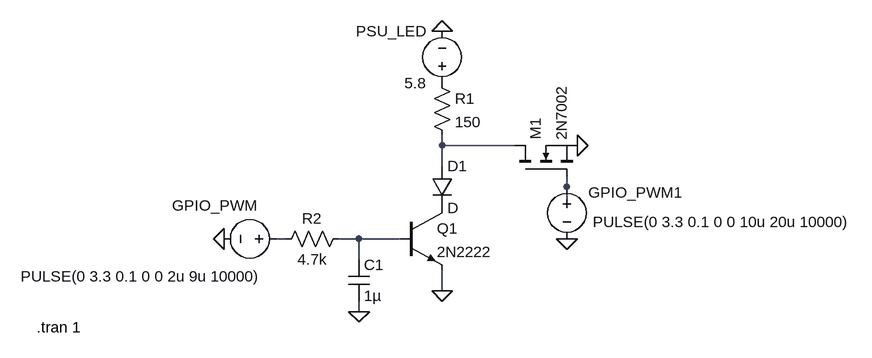
[diagram p0: schematic Draft1.asc]
Draft1.asc, the LTspice schematic file:
Version 4
SHEET 1 952 692
WIRE 224 128 224 112
WIRE 336 128 224 128
WIRE 224 160 224 128
WIRE 416 192 416 176
WIRE 416 224 416 192
WIRE -16 272 -32 272
WIRE 96 272 64 272
WIRE 160 272 96 272
WIRE 96 304 96 272
WIRE 224 352 224 320
WIRE 96 384 96 368
FLAG 224 -48 0
FLAG 224 352 0
FLAG 96 384 0
FLAG -112 272 0
FLAG 432 128 0
FLAG 416 272 0
SYMBOL res 208 16 R0
SYMATTR InstName R1
SYMATTR Value 150
SYMBOL voltage 224 48 R180
WINDOW 0 24 96 Left 2
WINDOW 3 24 16 Left 2
WINDOW 123 0 0 Left 0
WINDOW 39 0 0 Left 0
SYMATTR InstName PSU_LED
SYMATTR Value 5.8
SYMBOL diode 208 160 R0
SYMATTR InstName D1
SYMBOL npn 160 224 R0
SYMATTR InstName Q1
SYMATTR Value 2N2222
SYMBOL res 80 256 R90
WINDOW 0 0 56 VBottom 2
WINDOW 3 32 56 VTop 2
SYMATTR InstName R2
SYMATTR Value 4.7k
SYMBOL cap 80 304 R0
SYMATTR InstName C1
SYMATTR Value 1µ
SYMBOL voltage -16 272 R90
WINDOW 0 -36 110 VBottom 2
WINDOW 3 42 223 VTop 2
WINDOW 123 0 0 Left 0
WINDOW 39 0 0 Left 0
SYMATTR InstName GPIO_PWM
SYMATTR Value PULSE(0 3.3 0.1 0 0 2u 9u 10000)
SYMBOL nmos 336 176 R270
SYMATTR InstName M1
SYMATTR Value 2N7002
SYMBOL voltage 416 176 R0
WINDOW 0 106 40 Bottom 2
WINDOW 3 239 54 Top 2
WINDOW 123 0 0 Left 0
WINDOW 39 0 0 Left 0
SYMATTR InstName GPIO_PWM1
SYMATTR Value PULSE(0 3.3 0.1 0 0 10u 20u 10000)
TEXT -400 408 Left 2 !.tran 1

The netlist it stands for:
* Draft1.asc
R1 P001 N001 150
V§PSU_LED P001 0 5.8
D1 N001 P002 D
Q1 P002 N004 0 0 2N2222
R2 N004 N003 4.7k
C1 N004 0 1µ
V§GPIO_PWM N003 0 PULSE(0 3.3 0.1 0 0 2u 9u 10000)
M1 N001 N002 0 0 2N7002
V§GPIO_PWM1 N002 0 PULSE(0 3.3 0.1 0 0 10u 20u 10000)
.model D D
.lib standard.dio
.model NPN NPN
.model PNP PNP
.lib standard.bjt
.model NMOS NMOS
.model PMOS PMOS
.lib standard.mos
.tran 1
.backanno
.end